# Altium schematic sheet [05] - Probe Line IO Expanders.SchDoc: Probe Line IO Expanders
size A3; Date: N.A.; ApprovedBy: N.A.; CheckedBy: N.A.; Author: N.A.; CompanyName: Johannes Berndorfer; DrawnBy: JBE; Organization: N.A.; Address1: Konrad Grefe Gasse 22; Address2: 1230 Wien; Address3: AUSTRIA; Address4: N.A.; DocumentNumber: 5; Revision: A; SheetNumber: 5; SheetTotal: 8; ProjectTitle: Berndo Keyboard Switchboard PCB; Reviewer: -; Time: N.A.; ImagePath: N.A.; Application_BuildNumber: N.A.
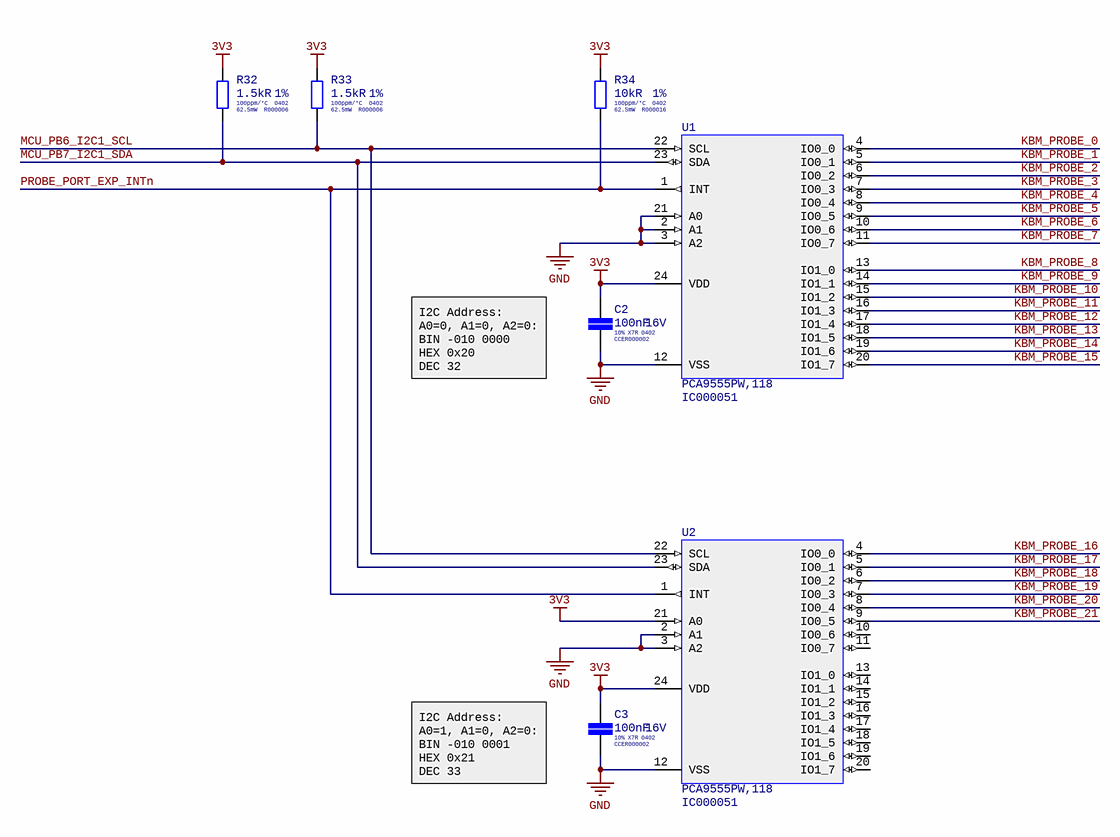
[diagram p0: [05] - Probe Line IO Expanders.SchDoc]

## Parts
C2  Tolerance: 10%  Internal Part Number: CCER000002  Voltage Rating (DC): 16V  Dielectric: X7R  Case/Package: 0402  Capacitance: 100nF  [CAP-SMD-0402-0.55MM-IPC-MED]  (hidden comment: 100nF 16V)
C3  Tolerance: 10%  Internal Part Number: CCER000002  Voltage Rating (DC): 16V  Dielectric: X7R  Case/Package: 0402  Capacitance: 100nF  [CAP-SMD-0402-0.55MM-IPC-MED]  (hidden comment: 100nF 16V)
R32  Temperature Coefficient: 100ppm/°C  Tolerance: 1%  Resistance: 1.5kR  Max Power Dissipation: 62.5mW  Case/Package: 0402  Internal Part Number: R000006  [RES-SMD-0402-0.4MM-IPC-MED]  (hidden comment: 1.5kR 1%)
R33  Temperature Coefficient: 100ppm/°C  Tolerance: 1%  Resistance: 1.5kR  Max Power Dissipation: 62.5mW  Case/Package: 0402  Internal Part Number: R000006  [RES-SMD-0402-0.4MM-IPC-MED]  (hidden comment: 1.5kR 1%)
R34  Tolerance: 1%  Temperature Coefficient: 100ppm/°C  Resistance: 10kR  Power Rating: 62.5mW  Case Code (Imperial): 0402  Internal Part Number: R000016  [RES-SMD-0402-0.4MM-IPC-MED]  (hidden comment: 10kR 1%)
U1  PCA9555PW,118  Internal Part Number: IC000051  [TSSOP-24-H1.1MM-P0.65MM-NXP]
U2  PCA9555PW,118  Internal Part Number: IC000051  [TSSOP-24-H1.1MM-P0.65MM-NXP]

## Nets
3V3: C2.1 C3.1 R32.1 R33.1 R34.1 U1.24(VDD) U2.21(A0) U2.24(VDD)
GND: C2.2 C3.2 U1.2(A1) U1.3(A2) U1.12(VSS) U1.21(A0) U2.2(A1) U2.3(A2) U2.12(VSS)
KBM_PROBE_0: U1.4(IO0_0)
KBM_PROBE_1: U1.5(IO0_1)
KBM_PROBE_2: U1.6(IO0_2)
KBM_PROBE_3: U1.7(IO0_3)
KBM_PROBE_4: U1.8(IO0_4)
KBM_PROBE_5: U1.9(IO0_5)
KBM_PROBE_6: U1.10(IO0_6)
KBM_PROBE_7: U1.11(IO0_7)
KBM_PROBE_8: U1.13(IO1_0)
KBM_PROBE_9: U1.14(IO1_1)
KBM_PROBE_10: U1.15(IO1_2)
KBM_PROBE_11: U1.16(IO1_3)
KBM_PROBE_12: U1.17(IO1_4)
KBM_PROBE_13: U1.18(IO1_5)
KBM_PROBE_14: U1.19(IO1_6)
KBM_PROBE_15: U1.20(IO1_7)
KBM_PROBE_16: U2.4(IO0_0)
KBM_PROBE_17: U2.5(IO0_1)
KBM_PROBE_18: U2.6(IO0_2)
KBM_PROBE_19: U2.7(IO0_3)
KBM_PROBE_20: U2.8(IO0_4)
KBM_PROBE_21: U2.9(IO0_5)
MCU_PB6_I2C1_SCL: R33.2 U1.22(SCL) U2.22(SCL)
MCU_PB7_I2C1_SDA: R32.2 U1.23(SDA) U2.23(SDA)
PROBE_PORT_EXP_INTn: R34.2 U1.1(INT) U2.1(INT)

Not connected (* = marked no-connect by the designer): U2 10(IO0_6) 11(IO0_7) 13(IO1_0) 14(IO1_1) 15(IO1_2) 16(IO1_3) 17(IO1_4) 18(IO1_5) 19(IO1_6) 20(IO1_7)

## Notes on the sheet
- I2C Address:
  A0=0, A1=0, A2=0:
  BIN -010 0000
  HEX 0x20
  DEC 32
- I2C Address:
  A0=1, A1=0, A2=0:
  BIN -010 0001
  HEX 0x21
  DEC 33
- Title:
- Project:
- Document Nr.:
- Revision:
- Date:
- Drawn By:
- Time:
- Reviewed By:
- Sheet
- of
- Size:
- A3
- Variant:
- File:

## Library data of the parts
C2 C3 = CL05B104KO5NNNC: CAP CER 100N 16V X7R 10% SMD 0402 125C SAMSUNG; Material: Ceramic; Supplier 1: Digi-Key; Manufacturer 1: Samsung; Manufacturer Part Number 1: CL05B104KO5NNNC; Stock 1: 53930414; Pricing 1: 1=0,10000, 10=0,02400, 100=0,01070, 500=0,00766, 1000=0,00602, 2500=0,00548, 5000=0,00504 (USD); RoHS: Yes; Mount: Surface Mount; Case Code (Metric): 1005; Case Code (Imperial): 0402; Contact Plating: Tin; Min Operating Temperature: -55°C; Max Operating Temperature: 125°C; Package Quantity: 1; Packaging: Tape and Reel; Voltage Rating: 16V; Voltage: 16V; Length: 1mm; Height: 0.5mm; Width: 0.02inch; Thickness: 0.022inch; Depth: 0.5mm; Radiation Hardening: No; Lead Free: Lead Free; ComponentLink1URL: https://datasheet.ciiva.com/26920/getdatasheetpartid-359683-26920169.pdf?src-supplier=Verical; ComponentLink1Description: https://datasheet.ciiva.com/26920/getdatasheetpartid-359683-26920169.pdf?src-supplier=Verical; ComponentLink2URL: https://datasheet.ciiva.com/29198/458718-da-01-en-vs-kondensator-0402-29198423.pdf?src-supplier=Conrad; ComponentLink2Description: https://datasheet.ciiva.com/29198/458718-da-01-en-vs-kondensator-0402-29198423.pdf?src-supplier=Conrad; ComponentLink3URL: https://datasheet.ciiva.com/16208/cl05b104kq5nnnc-16208343.pdf?src-supplier=Future+Electronics; ComponentLink3Description: https://datasheet.ciiva.com/16208/cl05b104kq5nnnc-16208343.pdf?src-supplier=Future+Electronics; ComponentLink4URL: https://datasheet.ciiva.com/26309/mlcc-catalogdownload2013-eng-26309003.pdf?src-supplier=Distrelec; ComponentLink4Description: https://datasheet.ciiva.com/26309/mlcc-catalogdownload2013-eng-26309003.pdf?src-supplier=Distrelec; Supplier Part Number 1: 1276-1001-6-ND
R32 R33 = RC0402FR-071K5L: RES 1K5 1% 1/16W SMD 0402 YAEGO; Manufacturer: Yageo; Voltage Rating: 50V; Supplier 1: Digi-Key; Manufacturer Part Number: RC0402FR-071K5L; Stock 1: 9091318; Pricing 1: 1 = 0,10000, 10 = 0,01600, 100 = 0,00640, 1000 = 0,00286, 2500 = 0,00248, 5000 = 0,00205 (USD); RoHS: Yes; Case Code (Metric): 1005; Case Code (Imperial): 0402; Min Operating Temperature: -55°C; Max Operating Temperature: 155°C; Package Quantity: 1; Power Rating: 62.5mW; Packaging: Tape and Reel; Composition: Thick Film; Number of Terminations: 2; Termination: SMD/SMT; Military Standard: Not; Features: Moisture Resistant; Length: 1mm; Height: 0.016inch; Width: 0.02inch; Depth: 0.5mm; REACH SVHC: No SVHC; Lead Free: Lead Free; ComponentLink1URL: https://datasheet.ciiva.com/11808/0900766b80c66297-11808238.pdf?src-supplier=RSComponents; ComponentLink1Description: https://datasheet.ciiva.com/11808/0900766b80c66297-11808238.pdf?src-supplier=RSComponents; ComponentLink2URL: https://datasheet.ciiva.com/2453/pyu-r-int-thick-7-2453440.pdf?src-supplier=Digi-Key; ComponentLink2Description: https://datasheet.ciiva.com/2453/pyu-r-int-thick-7-2453440.pdf?src-supplier=Digi-Key; ComponentLink3URL: https://datasheet.ciiva.com/2453/pyu-r-int-thick-7-2453441.pdf?src-supplier=Digi-Key; ComponentLink3Description: https://datasheet.ciiva.com/2453/pyu-r-int-thick-7-2453441.pdf?src-supplier=Digi-Key; ComponentLink4URL: https://datasheet.ciiva.com/46394/1018594-46394950.pdf?src-supplier=Element14; ComponentLink4Description: https://datasheet.ciiva.com/46394/1018594-46394950.pdf?src-supplier=Element14; ComponentLink5URL: https://datasheet.ciiva.com/7849/1018594-7849864.pdf?src-supplier=Element14; ComponentLink5Description: https://datasheet.ciiva.com/7849/1018594-7849864.pdf?src-supplier=Element14; ComponentLink6URL: https://datasheet.ciiva.com/15189/getdatasheetpartid-323992-15189370.pdf?src-supplier=Verical; ComponentLink6Description: https://datasheet.ciiva.com/15189/getdatasheetpartid-323992-15189370.pdf?src-supplier=Verical; ComponentLink7URL: https://datasheet.ciiva.com/7849/1018594-7849863.pdf?src-supplier=Element14; ComponentLink7Description: https://datasheet.ciiva.com/7849/1018594-7849863.pdf?src-supplier=Element14; ComponentLink8URL: https://datasheet.ciiva.com/12558/pyu-rc0402-51-rohs-l-6-r-8721-12558542.pdf?src-supplier=Mouser; ComponentLink8Description: https://datasheet.ciiva.com/12558/pyu-rc0402-51-rohs-l-6-r-8721-12558542.pdf?src-supplier=Mouser; ComponentLink9URL: https://datasheet.ciiva.com/2453/pyu-r-int-thick-7-2453439.pdf?src-supplier=Digi-Key; ComponentLink9Description: https://datasheet.ciiva.com/2453/pyu-r-int-thick-7-2453439.pdf?src-supplier=Digi-Key; Supplier Part Number 1: 311-1.50KLRCT-ND
R34 = RC0402FR-0710KL: RES 10K 1% 1/16W SMD 0402 YAEGO; Manufacturer: Yageo; Voltage Rating: 50V; Manufacturer Part Number: RC0402FR-0710KL; RoHS: Yes; Case/Package: 0402; Number of Pins: 2; Case Code (Metric): 1005; Min Operating Temperature: -55°C; Max Operating Temperature: 155°C; Packaging: Tape and Reel; Composition: Thick Film; Voltage Rating (DC): 50V; Termination: SMD/SMT; Military Standard: Not; Working Voltage: 50V; Number of Terminations: 2; Length: 1mm; Height: 0.32mm; Width: 0.5mm; Depth: 0.5mm; Lead Pitch: 0.2mm; REACH SVHC: No SVHC; Lead Free: Lead Free; ComponentLink1URL: https://datasheet.ciiva.com/7660/38568-7660787.pdf?src-supplier=Element14; ComponentLink1Description: https://datasheet.ciiva.com/7660/38568-7660787.pdf?src-supplier=Element14; ComponentLink2URL: https://datasheet.ciiva.com/7849/1784430-7849813.pdf?src-supplier=Element14; ComponentLink2Description: https://datasheet.ciiva.com/7849/1784430-7849813.pdf?src-supplier=Element14; ComponentLink3URL: https://datasheet.ciiva.com/7849/1686128-7849814.pdf?src-supplier=Element14; ComponentLink3Description: https://datasheet.ciiva.com/7849/1686128-7849814.pdf?src-supplier=Element14; ComponentLink4URL: https://datasheet.ciiva.com/7849/1784430-7849815.pdf?src-supplier=Element14; ComponentLink4Description: https://datasheet.ciiva.com/7849/1784430-7849815.pdf?src-supplier=Element14; ComponentLink5URL: https://datasheet.ciiva.com/22747/1018594-22747512.pdf?src-supplier=Element14; ComponentLink5Description: https://datasheet.ciiva.com/22747/1018594-22747512.pdf?src-supplier=Element14; ComponentLink6URL: https://datasheet.ciiva.com/12667/pyu-rc0402-51-rohs-l-6-r-12667067.pdf?src-supplier=Mouser; ComponentLink6Description: https://datasheet.ciiva.com/12667/pyu-rc0402-51-rohs-l-6-r-12667067.pdf?src-supplier=Mouser; ComponentLink7URL: https://datasheet.ciiva.com/7983/1018594-7983486.pdf?src-supplier=Element14; ComponentLink7Description: https://datasheet.ciiva.com/7983/1018594-7983486.pdf?src-supplier=Element14; Package Quantity: 10000; ComponentLink8URL: https://datasheet.ciiva.com/11819/0900766b80c66297-11819487.pdf?src-supplier=RSComponents; ComponentLink8Description: https://datasheet.ciiva.com/11819/0900766b80c66297-11819487.pdf?src-supplier=RSComponents; ComponentLink9URL: https://datasheet.ciiva.com/15189/getdatasheetpartid-329253-15189431.pdf?src-supplier=Verical; ComponentLink9Description: https://datasheet.ciiva.com/15189/getdatasheetpartid-329253-15189431.pdf?src-supplier=Verical; ComponentLink10URL: https://datasheet.ciiva.com/24070/pyu-rc0402-51-rohs-l-6-r-8721-24070077.pdf?src-supplier=Mouser; ComponentLink10Description: https://datasheet.ciiva.com/24070/pyu-rc0402-51-rohs-l-6-r-8721-24070077.pdf?src-supplier=Mouser; ComponentLink11URL: https://datasheet.ciiva.com/7849/1018594-7849966.pdf?src-supplier=Element14; ComponentLink11Description: https://datasheet.ciiva.com/7849/1018594-7849966.pdf?src-supplier=Element14; ComponentLink12URL: https://datasheet.ciiva.com/7849/1018594-7849967.pdf?src-supplier=Element14; ComponentLink12Description: https://datasheet.ciiva.com/7849/1018594-7849967.pdf?src-supplier=Element14; ComponentLink13URL: https://datasheet.ciiva.com/17070/pyu-rc0402-51-rohs-l-6-r-17070335.pdf?src-supplier=Future+Electronics; ComponentLink13Description: https://datasheet.ciiva.com/17070/pyu-rc0402-51-rohs-l-6-r-17070335.pdf?src-supplier=Future+Electronics; Supplier 1: Digi-Key; Stock 1: 86154015; Pricing 1: 1 = 0,10000, 10 = 0,01600, 100 = 0,00670, 1000 = 0,00301, 2500 = 0,00261, 5000 = 0,00215 (USD); Supplier Part Number 1: 311-10.0KLRCT-ND
U1 U2 = PCA9555PW,118: IC I/O EXPANDER I2C 16B 24TSSOP; Manufacturer: NXP Semiconductors; Number of I/Os: 16; Interface: I2C,SMBus,Serial; Output Current: 50mA; Nominal Supply Current: 160mA; Min Supply Voltage: 2.3V; Max Supply Voltage: 5.5V; Operating Supply Current: 135uA; Max Power Dissipation: 200mW; Frequency: 400kHz; Output Voltage: 4.1V; Supplier 1: Digi-Key; Manufacturer Part Number: PCA9555PW,118; Stock 1: 10944; Pricing 1: 1 = 1,70000, 10 = 1,52900, 100 = 1,22860, 500 = 1,00940, 1000 = 0,83636 (USD); RoHS: Yes; Mount: Surface Mount; Case/Package: TSSOP; Number of Pins: 24; Min Operating Temperature: -40°C; Max Operating Temperature: 85°C; Packaging: Tape and Reel; Package Quantity: 1; Max Frequency: 400kHz; Radiation Hardening: No; REACH SVHC: No SVHC; Lead Free: Lead Free; ComponentLink1URL: https://datasheet.ciiva.com/15134/getdatasheetpartid-148982-15134333.pdf?src-supplier=Verical; ComponentLink1Description: https://datasheet.ciiva.com/15134/getdatasheetpartid-148982-15134333.pdf?src-supplier=Verical; ComponentLink2URL: https://datasheet.ciiva.com/1780/pca9555-1780068.pdf?src-supplier=Digi-Key; ComponentLink2Description: https://datasheet.ciiva.com/1780/pca9555-1780068.pdf?src-supplier=Digi-Key; ComponentLink3URL: https://datasheet.ciiva.com/1504/1090559-1504901.pdf?src-supplier=Farnell; ComponentLink3Description: https://datasheet.ciiva.com/1504/1090559-1504901.pdf?src-supplier=Farnell; ComponentLink4URL: https://datasheet.ciiva.com/1780/pca9555-1780069.pdf?src-supplier=Digi-Key; ComponentLink4Description: https://datasheet.ciiva.com/1780/pca9555-1780069.pdf?src-supplier=Digi-Key; ComponentLink5URL: https://datasheet.ciiva.com/1780/pca9555-1780070.pdf?src-supplier=Digi-Key; ComponentLink5Description: https://datasheet.ciiva.com/1780/pca9555-1780070.pdf?src-supplier=Digi-Key; ComponentLink6URL: https://datasheet.ciiva.com/1495/1090559-1495945.pdf?src-supplier=Element14; ComponentLink6Description: https://datasheet.ciiva.com/1495/1090559-1495945.pdf?src-supplier=Element14; ComponentLink7URL: https://datasheet.ciiva.com/8122/pca9555-8122281.pdf?src-supplier=Avnet; ComponentLink7Description: https://datasheet.ciiva.com/8122/pca9555-8122281.pdf?src-supplier=Avnet; ComponentLink8URL: https://datasheet.ciiva.com/46381/1090559-46381881.pdf?src-supplier=Element14; ComponentLink8Description: https://datasheet.ciiva.com/46381/1090559-46381881.pdf?src-supplier=Element14; ComponentLink9URL: https://datasheet.ciiva.com/4826/pca9555-4826810.pdf?src-supplier=Mouser; ComponentLink9Description: https://datasheet.ciiva.com/4826/pca9555-4826810.pdf?src-supplier=Mouser; Supplier Part Number 1: 568-1058-1-ND